# Altium schematic sheet FPGA_Processor.SchDoc
size A4; Organization: Altium Limited; Address1: L3, 12a Rodborough Rd; Address2: Frenchs Forest; Address3: NSW; Address4: Australia 2086; DocumentNumber: 3; SheetNumber: 3; SheetTotal: 4
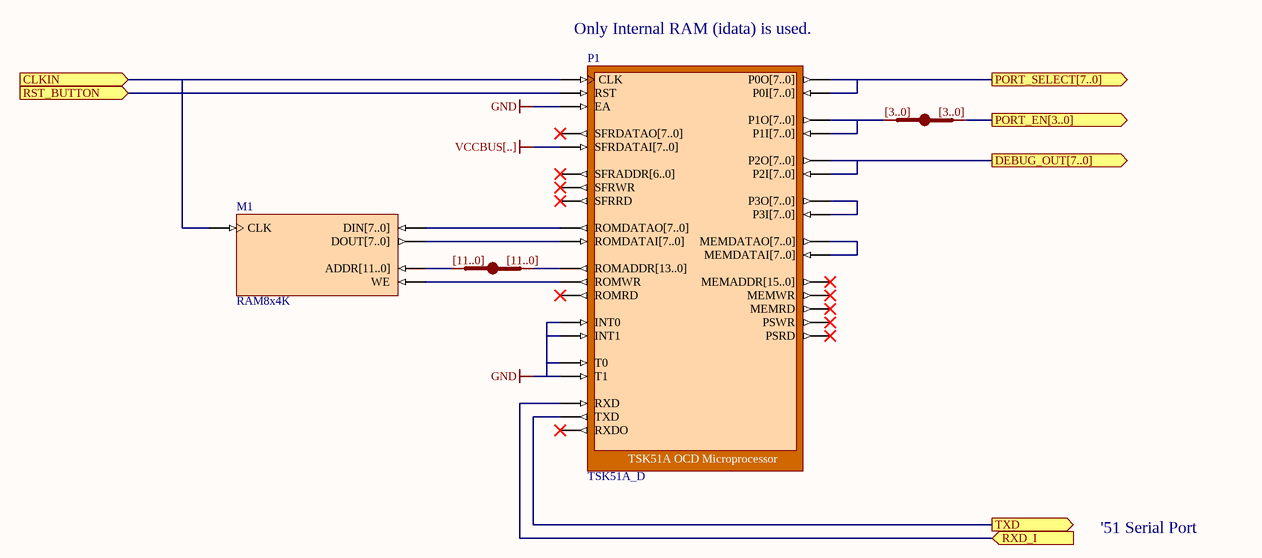
[diagram p0: FPGA_Processor.SchDoc]

## Parts
JB_S10  IndexA: [3..0]  (hidden comment: JB)
JB_S11  IndexA: [11..0]  (hidden comment: JB)
M1  RAM8x4K
P1  TSK51A_D

## Ports
CLKIN (in), DEBUG_OUT[7..0] (out), PORT_EN[3..0] (out), PORT_SELECT[7..0] (out), RST_BUTTON (in), RXD_I (in), TXD (out)

## Nets
GND: P1.EA P1.INT0 P1.INT1 P1.T0 P1.T1
VCCBUS[..]: P1.SFRDATAI[7..0]
CLKIN: M1.CLK P1.CLK ; port CLKIN
DEBUG_OUT[7..0]: P1.P2I[7..0] P1.P2O[7..0] ; port DEBUG_OUT[7..0]
PORT_EN[3..0]: JB_S10.B[0..0] ; port PORT_EN[3..0]
PORT_SELECT[7..0]: P1.P0I[7..0] P1.P0O[7..0] ; port PORT_SELECT[7..0]
RST_BUTTON: P1.RST ; port RST_BUTTON
RXD_I: P1.RXD ; port RXD_I
TXD: P1.TXD ; port TXD
NetJB_S10_A[0..0]: JB_S10.A[0..0] P1.P1I[7..0] P1.P1O[7..0]
NetJB_S11_A[0..0]: JB_S11.A[0..0] M1.ADDR[11..0]
NetJB_S11_B[0..0]: JB_S11.B[0..0] P1.ROMADDR[13..0]
NetM1_DIN[7..0]: M1.DIN[7..0] P1.ROMDATAO[7..0]
NetM1_DOUT[7..0]: M1.DOUT[7..0] P1.ROMDATAI[7..0]
NetM1_WE: M1.WE P1.ROMWR
NetP1_MEMDATAI[7..0]: P1.MEMDATAI[7..0] P1.MEMDATAO[7..0]
NetP1_P3I[7..0]: P1.P3I[7..0] P1.P3O[7..0]

Not connected (* = marked no-connect by the designer): P1 MEMADDR[15..0]* MEMRD* MEMWR* PSRD* PSWR* ROMRD* RXDO* SFRADDR[6..0]* SFRDATAO[7..0]* SFRRD* SFRWR*

## Notes on the sheet
- (near P1) Only Internal RAM (idata) is used.
- '51 Serial Port
- Title
- Size:
- Date:
- A4
- Number:
- Time:
- Revision:
- Sheet
- of
- File:

## Library data of the parts
JB_S10 JB_S11 = JB: System BUS Joiner; ArchiveName: GENERIC; Published: 18-Dec-2003; Publisher: Altium Limited; Core Revision: 1.00.00
  JB_S10: IndexB: [3..0]
  JB_S11: IndexB: [11..0]
M1 = RAM8x4K: Single Port Random Access Memory 4096 x 8; Memory_Depth: 4096; Memory_Type: RAM_SinglePortBlock; Memory_Width: 8; Memory_ClockEdge: Rising; Nexus_Core: Memory_Program; Published: 26/09/2003; Publisher: Altium Hobart Technology Center
P1 = TSK51A_D: TSK51A OCD Microprocessor; NEXUS_CORE: Processor_OCDS; NEXUS_JTAG_DEVICE: True; NEXUS_JTAG_ORDER: 0; ChildModel1: RAM256x8_TSK51D; ChildCore1: M1; Published: 23/10/2003; Publisher: Altium Hobart Technology Centre; Core Revision: 1.00.00